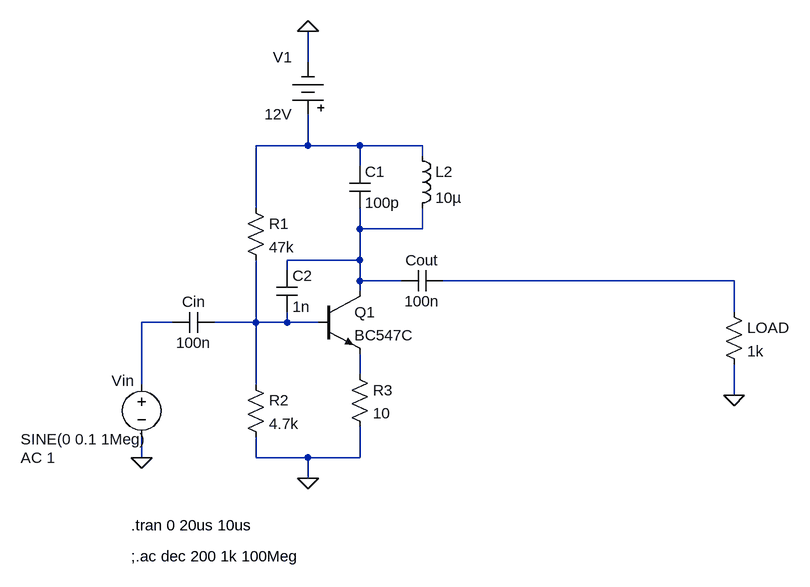
[diagram p0: schematic audion-analysis.asc]
audion-analysis.asc, the LTspice schematic file:
Version 4.1
SHEET 1 880 680
WIRE 128 -224 128 -272
WIRE 128 -96 128 -144
WIRE 128 -96 48 -96
WIRE 208 -96 128 -96
WIRE 304 -96 208 -96
WIRE 304 -80 304 -96
WIRE 208 -64 208 -96
WIRE 48 0 48 -96
WIRE 208 32 208 0
WIRE 304 32 304 0
WIRE 304 32 208 32
WIRE 208 80 208 32
WIRE 208 80 96 80
WIRE 96 96 96 80
WIRE 208 112 208 80
WIRE 272 112 208 112
WIRE 784 112 336 112
WIRE 208 128 208 112
WIRE 784 160 784 112
WIRE -80 176 -128 176
WIRE 48 176 48 80
WIRE 48 176 -16 176
WIRE 96 176 96 160
WIRE 96 176 48 176
WIRE 144 176 96 176
WIRE 208 256 208 224
WIRE -128 272 -128 176
WIRE 48 272 48 176
WIRE 784 288 784 240
WIRE -128 384 -128 352
WIRE 48 384 48 352
WIRE 128 384 48 384
WIRE 208 384 208 336
WIRE 208 384 128 384
WIRE 128 416 128 384
FLAG 128 -272 0
FLAG 784 288 0
FLAG -128 384 0
FLAG 128 416 0
SYMBOL npn 144 128 R0
SYMATTR InstName Q1
SYMATTR Value BC547C
SYMBOL res 32 -16 R0
SYMATTR InstName R1
SYMATTR Value 47k
SYMBOL res 32 256 R0
SYMATTR InstName R2
SYMATTR Value 4.7k
SYMBOL Misc\\battery 128 -128 R180
WINDOW 0 24 104 Left 2
WINDOW 3 24 16 Left 2
WINDOW 123 0 0 Left 0
WINDOW 39 0 0 Left 0
SYMATTR InstName V1
SYMATTR Value 12V
SYMBOL cap -16 160 R90
WINDOW 0 0 32 VBottom 2
WINDOW 3 32 32 VTop 2
SYMATTR InstName Cin
SYMATTR Value 100n
SYMBOL cap 336 96 R90
WINDOW 0 0 32 VBottom 2
WINDOW 3 32 32 VTop 2
SYMATTR InstName Cout
SYMATTR Value 100n
SYMBOL res 768 144 R0
SYMATTR InstName LOAD
SYMATTR Value 1k
SYMBOL voltage -128 256 R0
WINDOW 0 -46 10 Left 2
WINDOW 3 -186 100 Left 2
WINDOW 123 -186 128 Left 2
WINDOW 39 0 0 Left 0
SYMATTR InstName Vin
SYMATTR Value SINE(0 0.1 1Meg)
SYMATTR Value2 AC 1
SYMBOL cap 192 -64 R0
SYMATTR InstName C1
SYMATTR Value 100p
SYMBOL ind 288 -96 R0
SYMATTR InstName L2
SYMATTR Value 10µ
SYMBOL res 192 240 R0
SYMATTR InstName R3
SYMATTR Value 10
SYMBOL cap 80 96 R0
SYMATTR InstName C2
SYMATTR Value 1n
TEXT -144 536 Left 2 !;.ac dec 200 1k 100Meg
TEXT -144 488 Left 2 !.tran 0 20us 10us

The netlist it stands for:
* audion-analysis.asc
Q1 N002 N005 N006 0 BC547C
R1 N001 N005 47k
R2 N005 0 4.7k
V1 N001 0 12V
Cin N005 N004 100n
Cout N003 N002 100n
R§LOAD N003 0 1k
Vin N004 0 SINE(0 0.1 1Meg) AC 1
C1 N001 N002 100p
L2 N001 N002 10µ
R3 N006 0 10
C2 N002 N005 1n
.model NPN NPN
.model PNP PNP
.lib standard.bjt
;.ac dec 200 1k 100Meg
.tran 0 20us 10us
.backanno
.end